# Altium schematic sheet E17-04-CONNECTORS.SchDoc
size A; DocumentNumber: 11; SheetNumber: 11; SheetTotal: 18
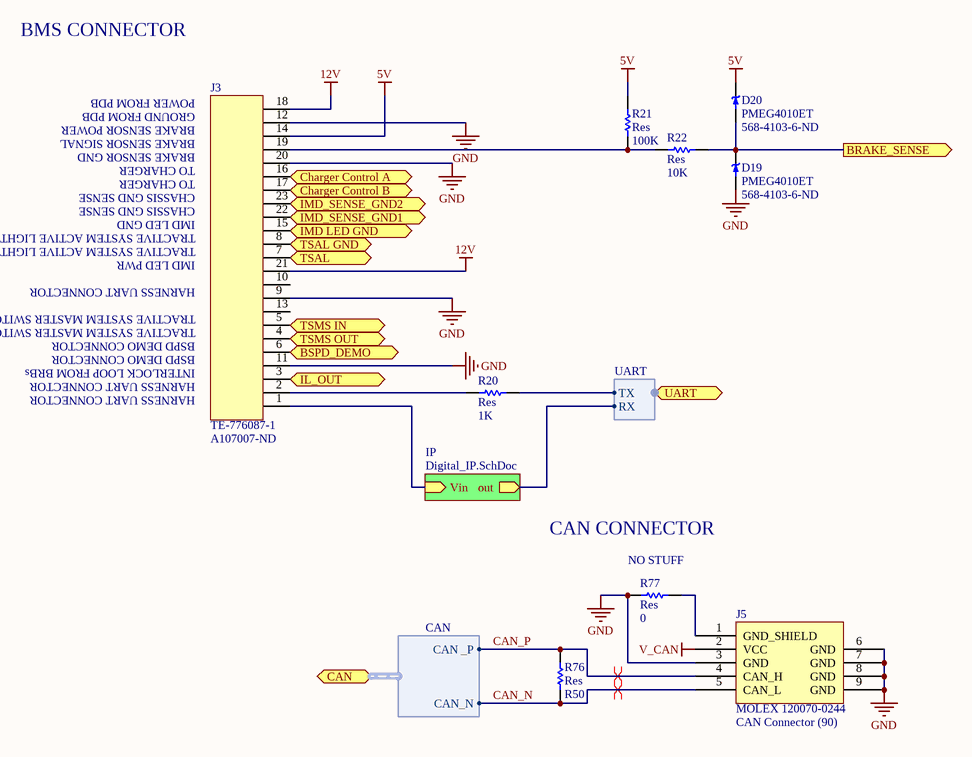
[diagram p0: E17-04-CONNECTORS.SchDoc]

## Parts
D19  PMEG4010ET  Supplier Part Number 1: 568-4103-6-ND  [SOT23-3]
D20  PMEG4010ET  Supplier Part Number 1: 568-4103-6-ND  [SOT23-3]
J3  TE-776087-1  Supplier Part Number 1: A107007-ND  [TE-776087-1]
J5  CAN Connector (90)  [CAN Connector (90)]
R20  Res  value 1K  [2012[0805]]
R21  Res  value 100K  [2012[0805]]
R22  Res  value 10K  [2012[0805]]
R76  Res  value R50  [2012[0805]]
R77  Res  value 0  [2012[0805]]

## Sub-sheets
IP = Digital_IP.SchDoc: Vin (in), out (out)

## Ports
BRAKE_SENSE (out), BSPD_DEMO (bidir), CAN (harness CAN), Charger Control A (out), Charger Control B (out), IL_OUT (out), IMD LED GND (out), IMD_SENSE_GND1 (out), IMD_SENSE_GND2 (out), TSAL (in), TSAL GND (in), TSMS IN, TSMS OUT, UART (harness UART)

## Harnesses
CAN: CAN _P, CAN_N
UART: RX, TX

## Nets
5V: D20.3 J3.14 R21.1
12V: J3.18 J3.21
GND: D19.1 J3.9 J3.11 J3.12 J3.20 J5.3(GND) J5.6(GND) J5.7(GND) J5.8(GND) J5.9(GND) R77.2
V_CAN: J5.2(VCC)
BRAKE_SENSE: D19.3 D20.1 R22.2 ; port BRAKE_SENSE
BSPD_DEMO: J3.6 ; port BSPD_DEMO
CAN_N: J5.5(CAN_L) R76.1 ; port CAN.CAN_N
CAN_P: J5.4(CAN_H) R76.2 ; port CAN.CAN _P
Charger Control A: J3.16 ; port Charger Control A
Charger Control B: J3.17 ; port Charger Control B
IL_OUT: J3.3 ; port IL_OUT
IMD LED GND: J3.15 ; port IMD LED GND
IMD_SENSE_GND1: J3.22 ; port IMD_SENSE_GND1
IMD_SENSE_GND2: J3.23 ; port IMD_SENSE_GND2
TSAL: J3.7 ; port TSAL
TSAL GND: J3.8 ; port TSAL GND
TSMS IN: J3.5 ; port TSMS IN
TSMS OUT: J3.4 ; port TSMS OUT
NetJ3_1: J3.1 ; sheet IP/Vin
NetJ3_2: J3.2 R20.1
NetJ3_19: J3.19 R21.2 R22.1
NetJ5_1: J5.1(GND_SHIELD) R77.1
NetR20_2: R20.2 ; port UART.TX
(unnamed): sheet IP/out, port UART.RX

Not connected (* = marked no-connect by the designer): J3 10 13

## Layout directives
differential pair: CAN_N, CAN_P

## Notes on the sheet
- BMS CONNECTOR
- POWER FROM PDB
- GROUND FROM PDB
- BRAKE SENSOR POWER
- BRAKE SENSOR SIGNAL
- BRAKE SENSOR GND
- TO CHARGER
- CHASSIS GND SENSE
- IMD LED GND
- TRACTIVE SYSTEM ACTIVE LIGHT
- IMD LED PWR
- TRACTIVE SYSTEM MASTER SWITCH
- HARNESS UART CONNECTOR
- INTERLOCK LOOP FROM BRBs
- BSPD DEMO CONNECTOR
- CAN CONNECTOR
- (near R77) NO STUFF
- (in symbol CAN Connector (90)) MOLEX 120070-0244

## Library data of the parts
D19 D20 = PMEG4010ET: SCHOTTKY RECT 40V 1A SOT-23; Supplier 1: Digi-Key
J3 = TE-776087-1: CONN HDR RTANG 23POS W/GASKT TIN; Supplier 1: Digi-Key
R20-R22 R76 R77 = Res: Surface Mount Resistor; Published: 8-Jun-2000; LatestRevisionDate: 17-Jul-2002; LatestRevisionNote: Re-released for DXP Platform.; PackageReference: AXIAL-0.5; Publisher: Altium Limited
J5 = CAN Connector (90): Supplier 1: Mouser